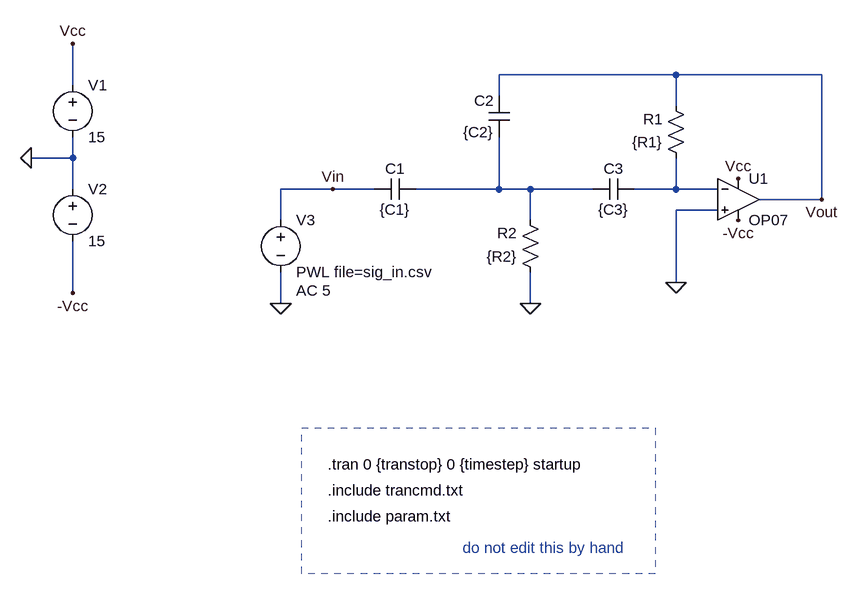
[diagram p0: schematic A8_AltaMFF_2.asc]
A8_AltaMFF_2.asc, the LTspice schematic file:
Version 4
SHEET 1 1076 708
WIRE 400 -64 128 -64
WIRE 624 -64 400 -64
WIRE -528 -48 -528 -112
WIRE 128 -32 128 -64
WIRE 400 -16 400 -64
WIRE -528 64 -528 32
WIRE -528 64 -592 64
WIRE -528 112 -528 64
WIRE -128 112 -208 112
WIRE -64 112 -128 112
WIRE 128 112 128 32
WIRE 128 112 0 112
WIRE 176 112 128 112
WIRE 272 112 176 112
WIRE 400 112 400 64
WIRE 400 112 336 112
WIRE 464 112 400 112
WIRE 624 128 624 -64
WIRE 624 128 528 128
WIRE 464 144 400 144
WIRE -208 160 -208 112
WIRE 176 160 176 112
WIRE 400 256 400 144
WIRE -528 272 -528 192
WIRE -208 288 -208 240
WIRE 176 288 176 240
FLAG -128 112 Vin
FLAG -592 64 0
FLAG -528 -112 Vcc
FLAG -528 272 -Vcc
FLAG -208 288 0
FLAG 176 288 0
FLAG 496 96 Vcc
FLAG 496 160 -Vcc
FLAG 624 128 Vout
FLAG 400 256 0
SYMBOL res 416 80 R180
WINDOW 0 36 76 Left 2
WINDOW 3 36 40 Left 2
SYMATTR InstName R1
SYMATTR Value {R1}
SYMBOL cap 0 96 R90
WINDOW 0 0 32 VBottom 2
WINDOW 3 32 32 VTop 2
SYMATTR InstName C1
SYMATTR Value {C1}
SYMBOL OpAmps\\OP07 496 64 R0
SYMATTR InstName U1
SYMBOL cap 144 32 R180
WINDOW 0 24 56 Left 2
WINDOW 3 24 8 Left 2
SYMATTR InstName C2
SYMATTR Value {C2}
SYMBOL voltage -528 -64 R0
WINDOW 123 0 0 Left 0
WINDOW 39 0 0 Left 0
SYMATTR InstName V1
SYMATTR Value 15
SYMBOL voltage -528 96 R0
WINDOW 123 0 0 Left 0
WINDOW 39 0 0 Left 0
SYMATTR InstName V2
SYMATTR Value 15
SYMBOL voltage -208 144 R0
WINDOW 123 24 124 Left 2
WINDOW 39 0 0 Left 0
SYMATTR Value2 AC 5
SYMATTR InstName V3
SYMATTR Value PWL file=sig_in.csv
SYMBOL res 192 256 R180
WINDOW 0 36 76 Left 2
WINDOW 3 36 40 Left 2
SYMATTR InstName R2
SYMATTR Value {R2}
SYMBOL cap 272 128 R270
WINDOW 0 32 32 VTop 2
WINDOW 3 0 32 VBottom 2
SYMATTR InstName C3
SYMATTR Value {C3}
TEXT -136 536 Left 2 !.tran 0 {transtop} 0 {timestep} startup
TEXT -136 616 Left 2 !.include param.txt
TEXT -136 576 Left 2 !.include trancmd.txt
TEXT 72 664 Left 2 ;do not edit this by hand
RECTANGLE Normal 368 704 -176 480 2

The netlist it stands for:
* A8_AltaMFF_2.asc
R1 N002 Vout {R1}
C1 N001 Vin {C1}
XU1 0 N002 Vcc -Vcc Vout LT1001  ; OP07, pins In+ In- V+ V- OUT
C2 N001 Vout {C2}
V1 Vcc 0 15
V2 0 -Vcc 15
V3 Vin 0 PWL file=sig_in.csv AC 5
R2 0 N001 {R2}
C3 N001 N002 {C3}
.tran 0 {transtop} 0 {timestep} startup
.include param.txt
.include trancmd.txt
* do not edit this by hand
.lib LTC.lib
.backanno
.end

* Results of the author's LTspice run, read from the files saved beside the schematic
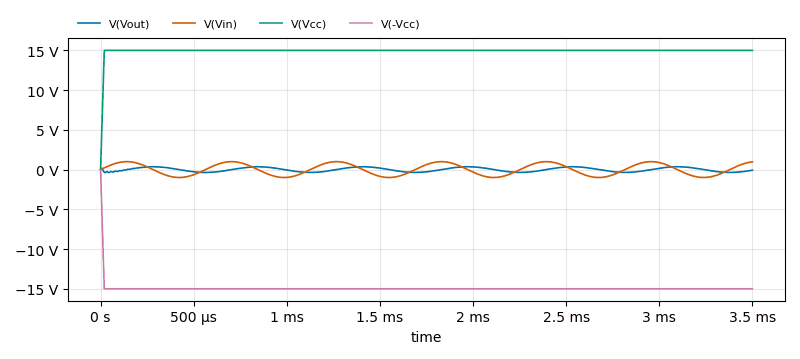
[diagram p1: Transient Analysis of A8_AltaMFF_2.asc, plotted from the saved traces]
* Transient Analysis, 1 run:
*   V(Vout): min -384.4 mV, max 358.3 mV, average -8.68 mV, rms 252.3 mV, last -77.09 mV
*   V(Vin): min -999.9 mV, max 1 V, average 20.07 mV, rms 704.5 mV, last 976.6 mV
*   V(Vcc): min 0 V, max 15 V, average 14.96 V, rms 14.97 V, last 15 V
*   V(-Vcc): min -15 V, max 0 V, average -14.96 V, rms 14.97 V, last -15 V